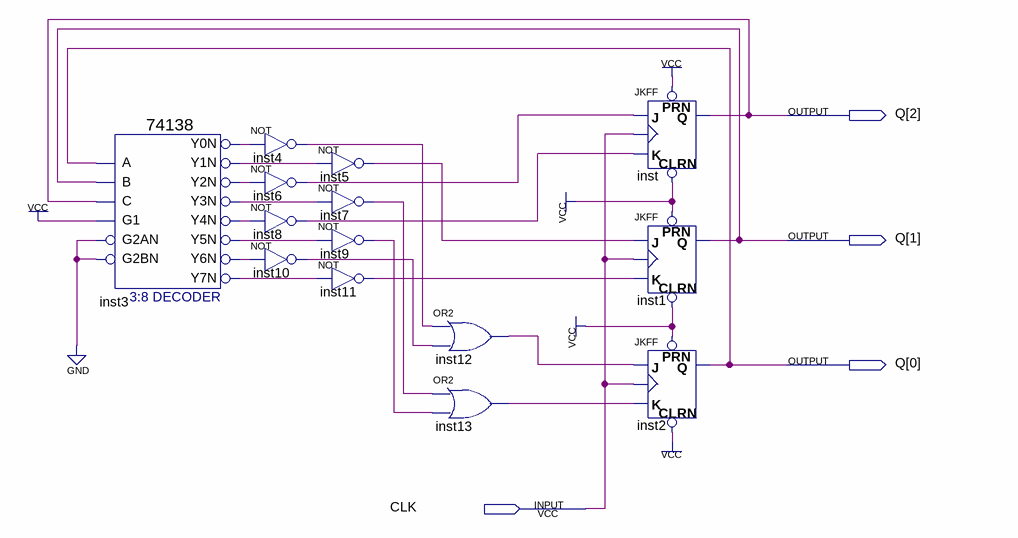
[diagram p0: schematic sheet]
// Quartus schematic graycode.bdf as structural Verilog: 14 symbols, 4 pins
module graycode (
  input  CLK,
  output [2:0] Q
);

  wire inst3_y0n, inst3_y1n, inst3_y2n, inst3_y3n, inst3_y4n, inst3_y5n, inst3_y6n, inst3_y7n, inst4_out,
       inst5_out, inst6_out, inst7_out, inst8_out, inst9_out, inst10_out, inst11_out, inst12_out, inst13_out;

  \74138  inst3 (
    .A(Q[0]), .B(Q[1]), .G1(1'b1), .C(Q[2]), .G2AN(1'b0), .G2BN(1'b0), .Y0N(inst3_y0n), .Y1N(inst3_y1n),
    .Y2N(inst3_y2n), .Y3N(inst3_y3n), .Y4N(inst3_y4n), .Y5N(inst3_y5n), .Y6N(inst3_y6n), .Y7N(inst3_y7n));
  not inst4 (inst4_out, inst3_y0n);
  not inst6 (inst6_out, inst3_y2n);
  not inst8 (inst8_out, inst3_y4n);
  not inst10 (inst10_out, inst3_y6n);
  not inst5 (inst5_out, inst3_y1n);
  not inst7 (inst7_out, inst3_y3n);
  not inst9 (inst9_out, inst3_y5n);
  not inst11 (inst11_out, inst3_y7n);
  or inst12 (inst12_out, inst4_out, inst10_out);
  or inst13 (inst13_out, inst7_out, inst9_out);
  JKFF inst (.PRN(1'b1), .CLRN(1'b1), .K(inst8_out), .J(inst6_out), .CLK(CLK), .Q(Q[2]));
  JKFF inst1 (.PRN(1'b1), .CLRN(1'b1), .K(inst11_out), .J(inst5_out), .CLK(CLK), .Q(Q[1]));
  JKFF inst2 (.PRN(1'b1), .CLRN(1'b1), .K(inst13_out), .J(inst12_out), .CLK(CLK), .Q(Q[0]));
endmodule
